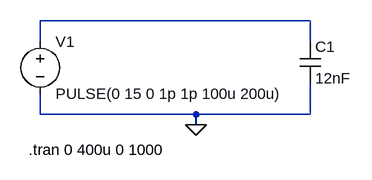
[diagram p0: schematic gatedrive_veryideal.asc]
gatedrive_veryideal.asc, the LTspice schematic file:
Version 4
SHEET 1 880 680
WIRE 496 112 80 112
WIRE 80 144 80 112
WIRE 496 144 496 112
WIRE 80 256 80 224
WIRE 320 256 80 256
WIRE 496 256 496 208
WIRE 496 256 320 256
WIRE 320 272 320 256
FLAG 320 272 0
SYMBOL voltage 80 128 R0
WINDOW 123 0 0 Left 0
WINDOW 39 0 0 Left 0
SYMATTR InstName V1
SYMATTR Value PULSE(0 15 0 1p 1p 100u 200u)
SYMBOL cap 480 144 R0
SYMATTR InstName C1
SYMATTR Value 12nF
TEXT 62 310 Left 2 !.tran 0 400u 0 1000

The netlist it stands for:
* gatedrive_veryideal.asc
V1 N001 0 PULSE(0 15 0 1p 1p 100u 200u)
C1 N001 0 12nF
.tran 0 400u 0 1000
.backanno
.end